# Altium schematic sheet Sheet3.SchDoc: Projet M1 équipe 2
size A4; DrawnBy: Jordan Chevalier; DocumentNumber: 1; Revision: V1.0 Rev A; SheetNumber: 3; SheetTotal: 3
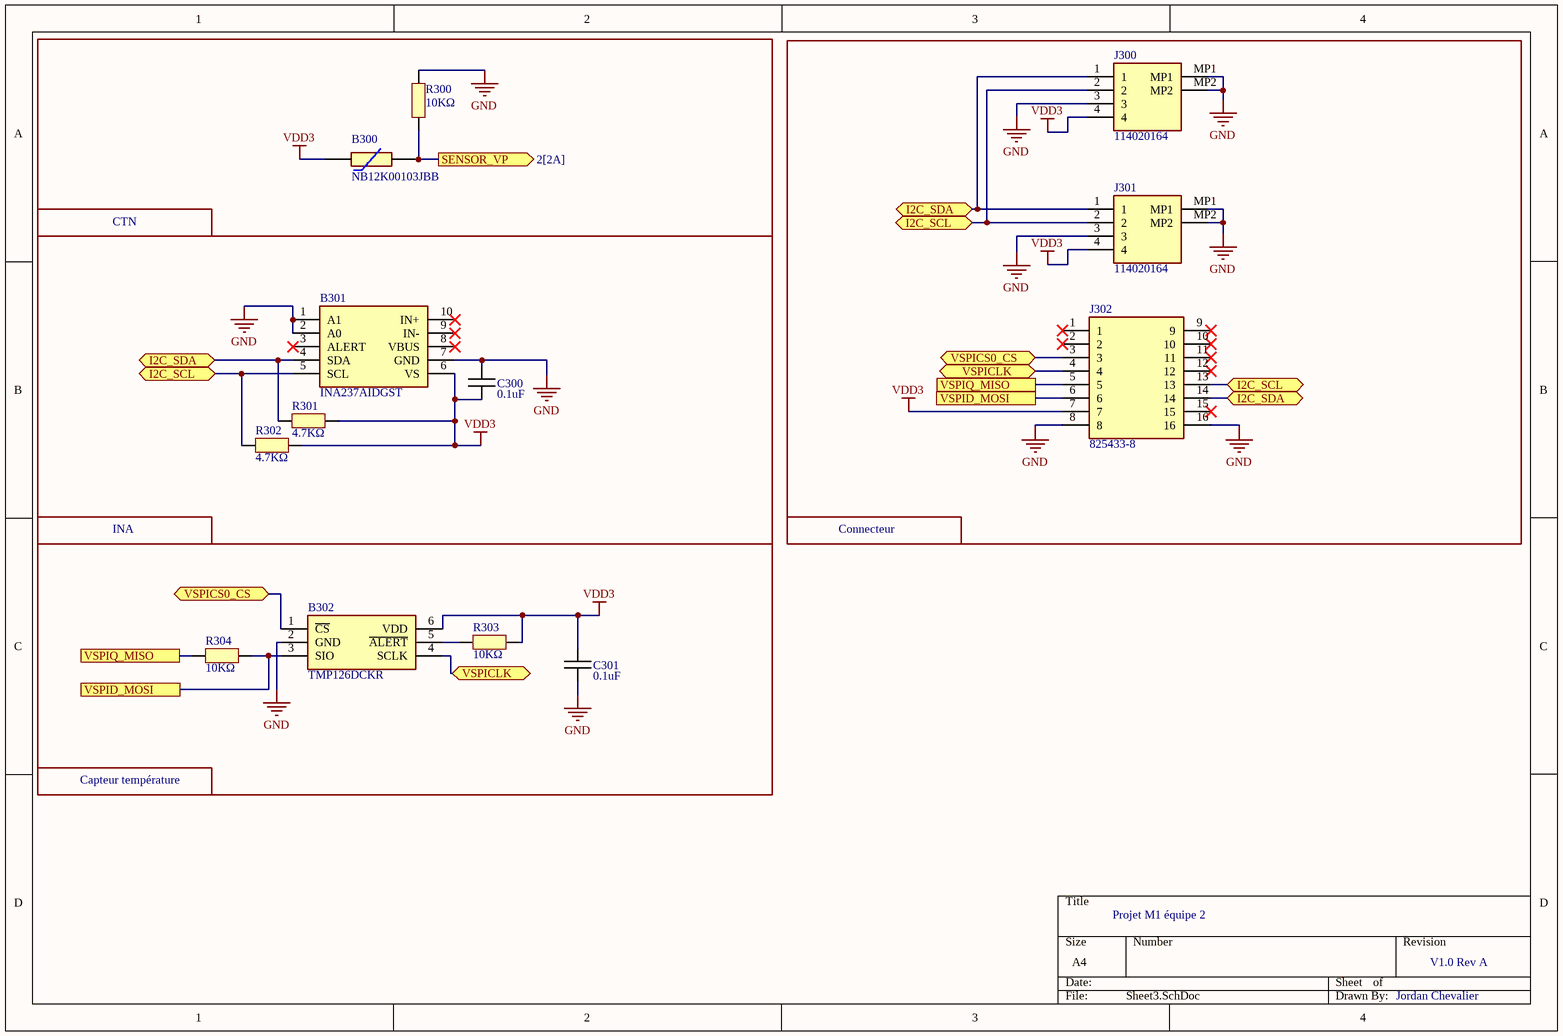
[diagram p0: Sheet3.SchDoc]

## Parts
B300  NB12K00103JBB  [RESC2212X50N]
B301  INA237AIDGST  [SOP50P490X110-10N]
B302  TMP126DCKR  [SOT65P210X110-6N]
C300  0.1uF  [CAPC1005X06N]
C301  0.1uF  [CAPC1005X06N]
J300  114020164  [114020164]
J301  114020164  [114020164]
J302  825433-8  [Connect-Mikronus]
R300  10KΩ  [RESC1005X06N]
R301  4.7KΩ  [RESC1005X06N]
R302  4.7KΩ  [RESC1005X06N]
R303  10KΩ  [RESC1005X06N]
R304  10KΩ  [RESC1005X06N]

## Blocks framed on the sheet
CTN: B300 R300
Capteur température: B302 C301 R303 R304
Connecteur: J300-J302
INA: B301 C300 R301 R302

## Ports
I2C_SCL (bidir, see 2[2B], 3[1B], 3[3A]), I2C_SCL (bidir, see 2[2B], 3[1B], 3[4B]), I2C_SCL (bidir, see 2[2B], 3[3A], 3[4B]), I2C_SDA (bidir, see 2[2B], 3[1B], 3[3A]), I2C_SDA (bidir, see 2[2B], 3[1B], 3[4B]), I2C_SDA (bidir, see 2[2B], 3[3A], 3[4B]), SENSOR_VP (out, see 2[2A]), VSPICLK (bidir, see 2[2B], 3[2C]), VSPICLK (bidir, see 2[2B], 3[3B]), VSPICS0_CS (bidir, see 2[2B], 3[1C]), VSPICS0_CS (bidir, see 2[2B], 3[3B]), VSPID_MOSI (see 2[3B], 3[1C]), VSPID_MOSI (see 2[3B], 3[3B]), VSPIQ_MISO (see 2[3B], 3[1C]), VSPIQ_MISO (see 2[3B], 3[3B])

## Nets
GND: B301.1(A1) B301.2(A0) B301.7(GND) B302.2(GND) C300.1 C301.2 J300.3 J300.MP1 J300.MP2 J301.3 J301.MP1 J301.MP2 J302.8 J302.16 R300.2
VDD3: B300.1 B301.6(VS) B302.6(VDD) C300.2 C301.1 J300.4 J301.4 J302.7 R301.2 R302.2 R303.2
I2C_SCL: B301.5(SCL) J300.2 J301.2 J302.13 R302.1 ; port I2C_SCL
I2C_SDA: B301.4(SDA) J300.1 J301.1 J302.14 R301.1 ; port I2C_SDA
SENSOR_VP: B300.2 R300.1 ; port SENSOR_VP
VSPICLK: B302.4(SCLK) J302.4 ; port VSPICLK
VSPICS0_CS: B302.1(~{CS}) J302.3 ; port VSPICS0_CS
VSPID_MOSI: B302.3(SIO) J302.6 R304.2 ; port VSPID_MOSI
VSPIQ_MISO: J302.5 R304.1 ; port VSPIQ_MISO
NetB302_5: B302.5(~{ALERT}) R303.1

Not connected (* = marked no-connect by the designer): B301 3(ALERT)* 8(VBUS)* 9(IN-)* 10(IN+)*; J302 1* 2* 9* 10* 11* 12* 15*

## Library data of the parts
B300 = NB12K00103JBB: NTC SMD Thermistor, NB12K, 10K, 5% AVX 10k 0805 Protection NTC Thermistor, 5s, 2 x 1.25 x 1.3mm; Manufacturer_Name: Kyocera AVX; Geometry.Height: 0.5mm; Manufacturer_Part_Number: NB12K00103JBB; Mouser Part Number: 581-NB12K00103JBB; Mouser Price/Stock: https://www.mouser.co.uk/ProductDetail/AVX/NB12K00103JBB/?qs=4%252B6%252BTdINQeDPvI%252BQUQjJ3Q%3D%3D; Arrow Part Number: NB12K00103JBB; Arrow Price/Stock: https://www.arrow.com/en/products/nb12k00103jbb/avx; Datasheet Link: https://datasheet.datasheetarchive.com/originals/distributors/Datasheets-DGA6/551314.pdf
B301 = INA237AIDGST: Current Sense Amplifiers 85-V, 16-bit, I2C output current/voltage/power monitor with alert 10-VSSOP -40 to 125; Manufacturer_Name: Texas Instruments; Manufacturer_Part_Number: INA237AIDGST; Mouser Part Number: 595-INA237AIDGST
B302 = TMP126DCKR: Board Mount Temperature Sensors +/-0.25 C SPI temperature sensor with 175 C operation, CRC and slew-rate alert; Manufacturer_Name: Texas Instruments; Manufacturer_Part_Number: TMP126DCKR; Mouser Part Number: 595-TMP126DCKR
C300 C301 = Capacitor
J300 J301 = 114020164: Seeed Studio Accessories Grove Female Header - SMD-4P-2.0mm-90D-20Pcs; Manufacturer_Name: Seeed Studio; Manufacturer_Part_Number: 114020164; Mouser Part Number: 713-114020164
J302 = Connect-Mikrobus: Headers & Wire Housings 8P double for connection mikrobus; Manufacturer_Name: TE Connectivity; Manufacturer_Part_Number: 825433-8; Mouser Part Number: 571-825433-8
R300-R304 = Resistor